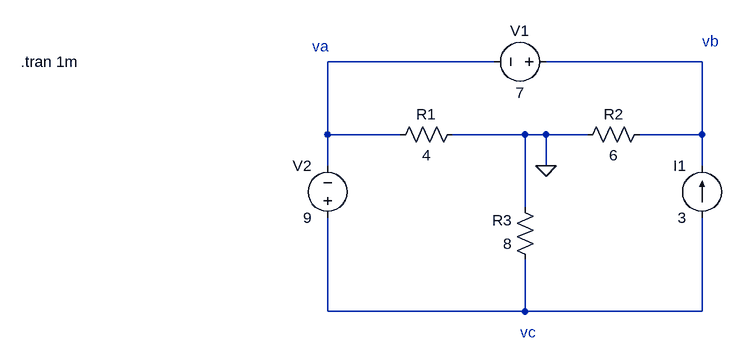
[diagram p0: schematic Q7 att 3.asc]
Q7 att 3.asc, the LTspice schematic file:
Version 4.1
SHEET 1 880 680
WIRE 144 80 -112 80
WIRE 464 80 224 80
WIRE -112 192 -112 80
WIRE 0 192 -112 192
WIRE 192 192 80 192
WIRE 224 192 192 192
WIRE 288 192 224 192
WIRE 464 192 464 80
WIRE 464 192 368 192
WIRE -112 240 -112 192
WIRE 224 240 224 192
WIRE 464 240 464 192
WIRE 192 304 192 192
WIRE -112 464 -112 320
WIRE 192 464 192 384
WIRE 192 464 -112 464
WIRE 464 464 464 320
WIRE 464 464 192 464
FLAG 224 240 0
SYMBOL voltage 240 80 R90
WINDOW 0 -32 56 VBottom 2
WINDOW 3 32 56 VTop 2
WINDOW 123 0 0 Left 0
WINDOW 39 0 0 Left 0
SYMATTR InstName V1
SYMATTR Value 7
SYMBOL voltage -112 336 R180
WINDOW 0 24 96 Left 2
WINDOW 3 24 16 Left 2
WINDOW 123 0 0 Left 0
WINDOW 39 0 0 Left 0
SYMATTR InstName V2
SYMATTR Value 9
SYMBOL current 464 320 R180
WINDOW 0 24 80 Left 2
WINDOW 3 24 0 Left 2
WINDOW 123 0 0 Left 0
WINDOW 39 0 0 Left 0
SYMATTR InstName I1
SYMATTR Value 3
SYMBOL res 96 176 R90
WINDOW 0 0 56 VBottom 2
WINDOW 3 32 56 VTop 2
SYMATTR InstName R1
SYMATTR Value 4
SYMBOL res 384 176 R90
WINDOW 0 0 56 VBottom 2
WINDOW 3 32 56 VTop 2
SYMATTR InstName R2
SYMATTR Value 6
SYMBOL res 208 400 R180
WINDOW 0 36 76 Left 2
WINDOW 3 36 40 Left 2
SYMATTR InstName R3
SYMATTR Value 8
TEXT -584 80 Left 2 !.tran 1m
TEXT -136 56 Left 2 ;va
TEXT 464 48 Left 2 ;vb
TEXT 184 496 Left 2 ;vc

The netlist it stands for:
* Q7 att 3.asc
V1 N002 N001 7
V2 N003 N001 9
I1 N003 N002 3
R1 0 N001 4
R2 N002 0 6
R3 N003 0 8
.tran 1m
* va
* vb
* vc
.backanno
.end